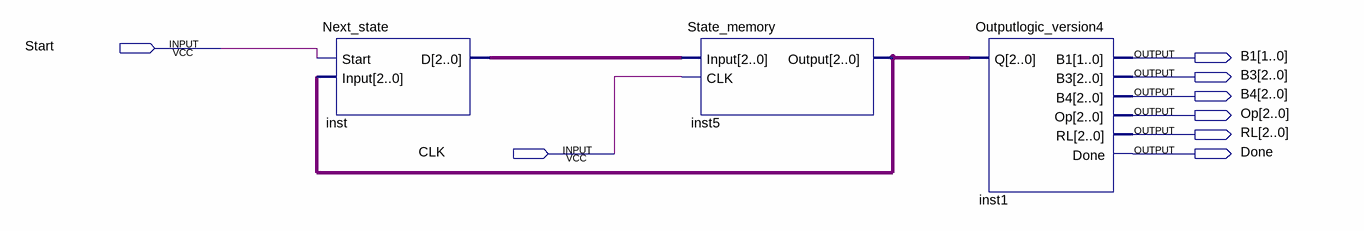
[diagram p0: schematic sheet]
// Quartus schematic Controller_version4.bdf as structural Verilog: 3 symbols, 8 pins
module Controller_version4 (
  input  Start,
  input  CLK,
  output [1:0] B1,
  output [2:0] B3,
  output [2:0] B4,
  output [2:0] Op,
  output [2:0] RL,
  output Done
);

  wire [2:0] inst5_output, inst_d;

  Next_state inst (.Start(Start), .Input(inst5_output), .D(inst_d));
  State_memory inst5 (.Input(inst_d), .CLK(CLK), .Output(inst5_output));
  Outputlogic_version4 inst1 (.Q(inst5_output), .B1(B1), .B3(B3), .B4(B4), .Op(Op), .RL(RL), .Done(Done));
endmodule
